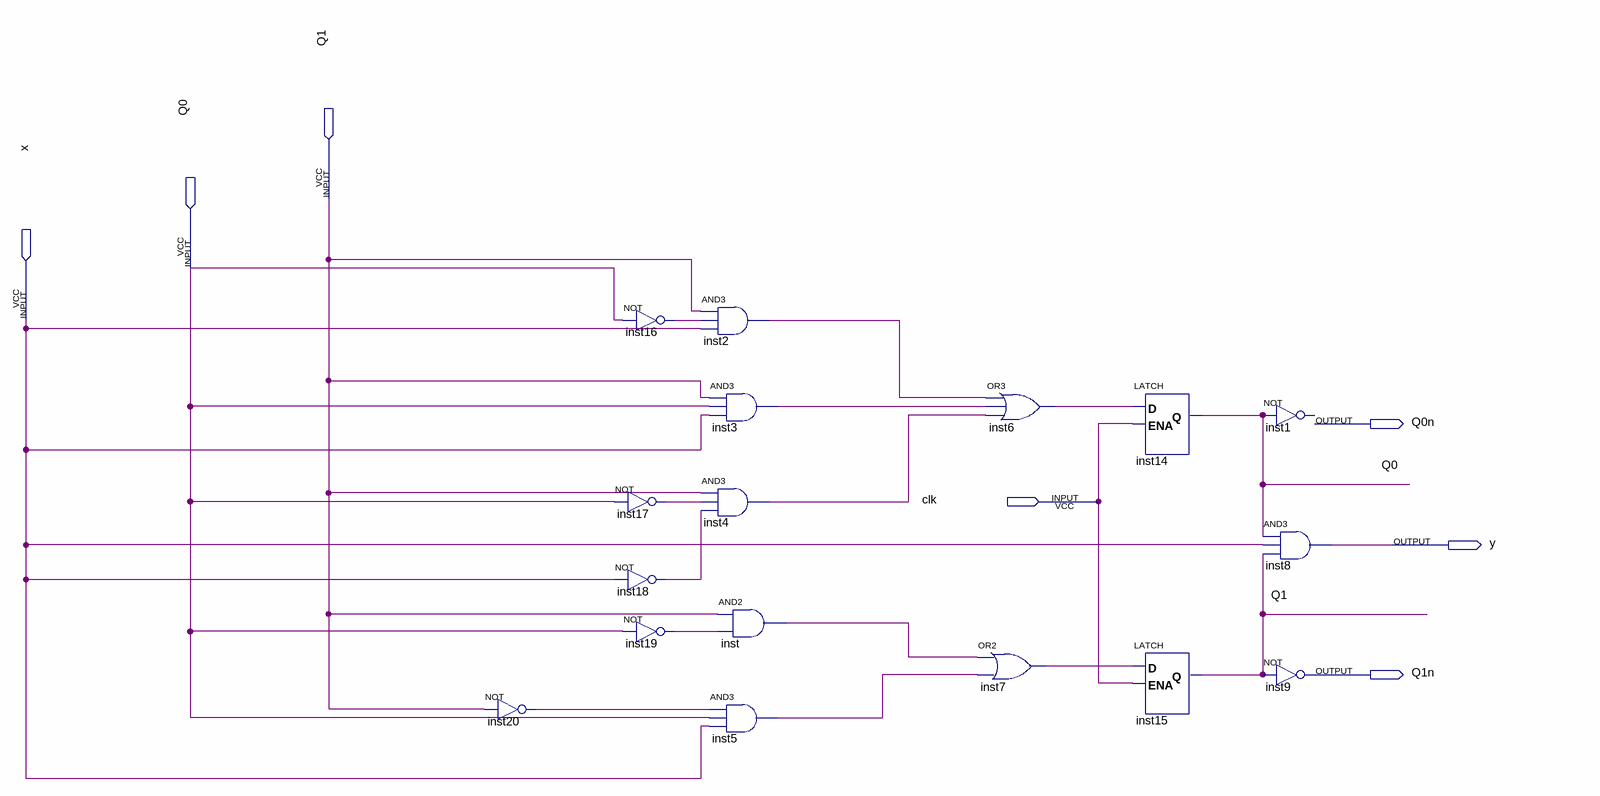
[diagram p0: schematic sheet]
// Quartus schematic SeqDet1101.bdf as structural Verilog: 17 symbols, 7 pins
module SeqDet1101 (
  input  Q1,
  input  Q0,
  input  x,
  input  clk,
  output Q0n,
  output y,
  output Q1n
);

  wire inst2_out, inst3_out, inst4_out, inst5_out, inst6_out, inst7_out, inst16_out, inst17_out, inst18_out,
       inst19_out, inst20_out, inst_out;

  not inst20 (inst20_out, Q1);
  not inst16 (inst16_out, Q0);
  not inst17 (inst17_out, Q0);
  not inst18 (inst18_out, x);
  not inst19 (inst19_out, Q0);
  and inst2 (inst2_out, Q1, inst16_out, x);
  and inst4 (inst4_out, Q1, inst17_out, inst18_out);
  and inst3 (inst3_out, Q1, Q0, x);
  and inst (inst_out, Q1, inst19_out);
  and inst5 (inst5_out, inst20_out, Q0, x);
  or inst7 (inst7_out, inst_out, inst5_out);
  or inst6 (inst6_out, inst2_out, inst3_out, inst4_out);
  LATCH inst14 (.D(inst6_out), .ENA(clk), .Q(Q0));
  LATCH inst15 (.D(inst7_out), .ENA(clk), .Q(Q1));
  // NOT inst1 has open pins: IN=Q0, OUT=open
  and inst8 (y, Q0, x, Q1);
  not inst9 (Q1n, Q1);
endmodule
